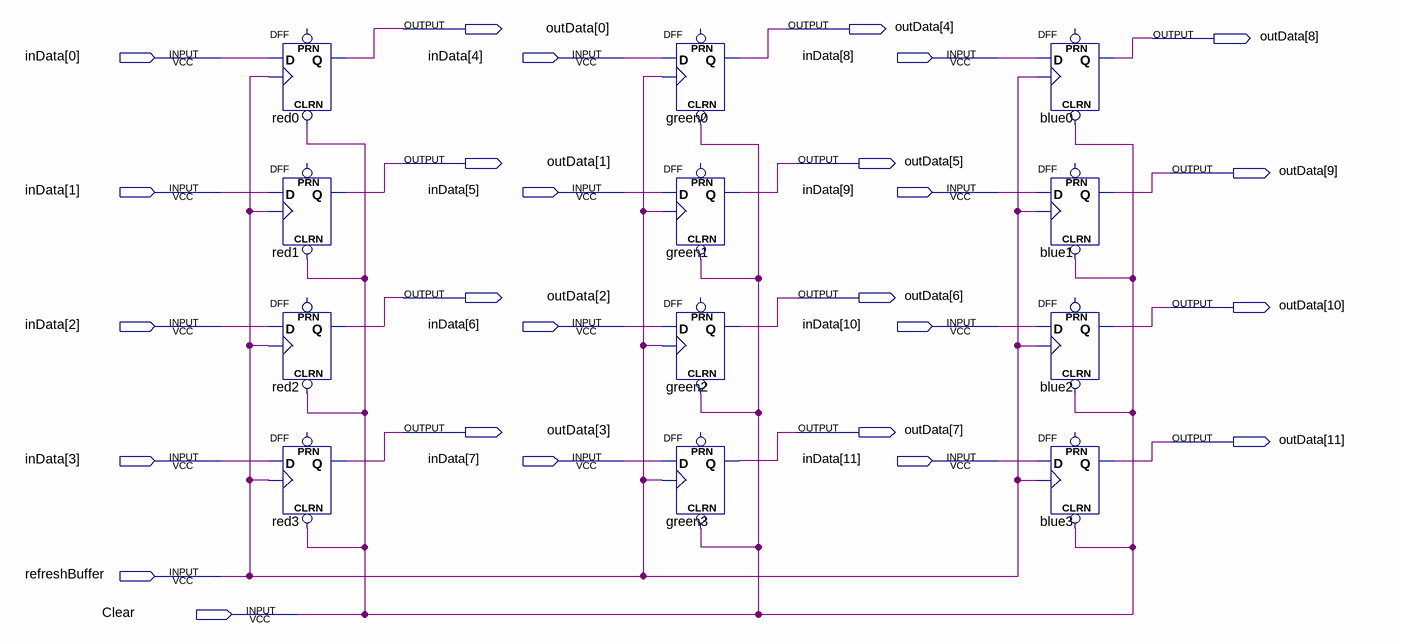
[diagram p0: schematic sheet]
// Quartus schematic bufferColor.bdf as structural Verilog: 12 symbols, 26 pins
module bufferColor (
  input  [11:0] inData,
  input  refreshBuffer,
  input  Clear,
  output [11:0] outData
);

  DFF red0 (.CLRN(Clear), .CLK(refreshBuffer), .D(inData[0]), .Q(outData[0]));  // open: PRN
  DFF red1 (.CLRN(Clear), .CLK(refreshBuffer), .D(inData[1]), .Q(outData[1]));  // open: PRN
  DFF red2 (.CLRN(Clear), .CLK(refreshBuffer), .D(inData[2]), .Q(outData[2]));  // open: PRN
  DFF red3 (.CLRN(Clear), .CLK(refreshBuffer), .D(inData[3]), .Q(outData[3]));  // open: PRN
  DFF green0 (.CLRN(Clear), .CLK(refreshBuffer), .D(inData[4]), .Q(outData[4]));  // open: PRN
  DFF green1 (.CLRN(Clear), .CLK(refreshBuffer), .D(inData[5]), .Q(outData[5]));  // open: PRN
  DFF green2 (.CLRN(Clear), .CLK(refreshBuffer), .D(inData[6]), .Q(outData[6]));  // open: PRN
  DFF green3 (.CLRN(Clear), .CLK(refreshBuffer), .D(inData[7]), .Q(outData[7]));  // open: PRN
  DFF blue0 (.CLRN(Clear), .CLK(refreshBuffer), .D(inData[8]), .Q(outData[8]));  // open: PRN
  DFF blue1 (.CLRN(Clear), .CLK(refreshBuffer), .D(inData[9]), .Q(outData[9]));  // open: PRN
  DFF blue2 (.CLRN(Clear), .CLK(refreshBuffer), .D(inData[10]), .Q(outData[10]));  // open: PRN
  DFF blue3 (.CLRN(Clear), .CLK(refreshBuffer), .D(inData[11]), .Q(outData[11]));  // open: PRN
endmodule
